# Altium schematic sheet 3-PWR_BAK_BATT.SCHDOC
size A4
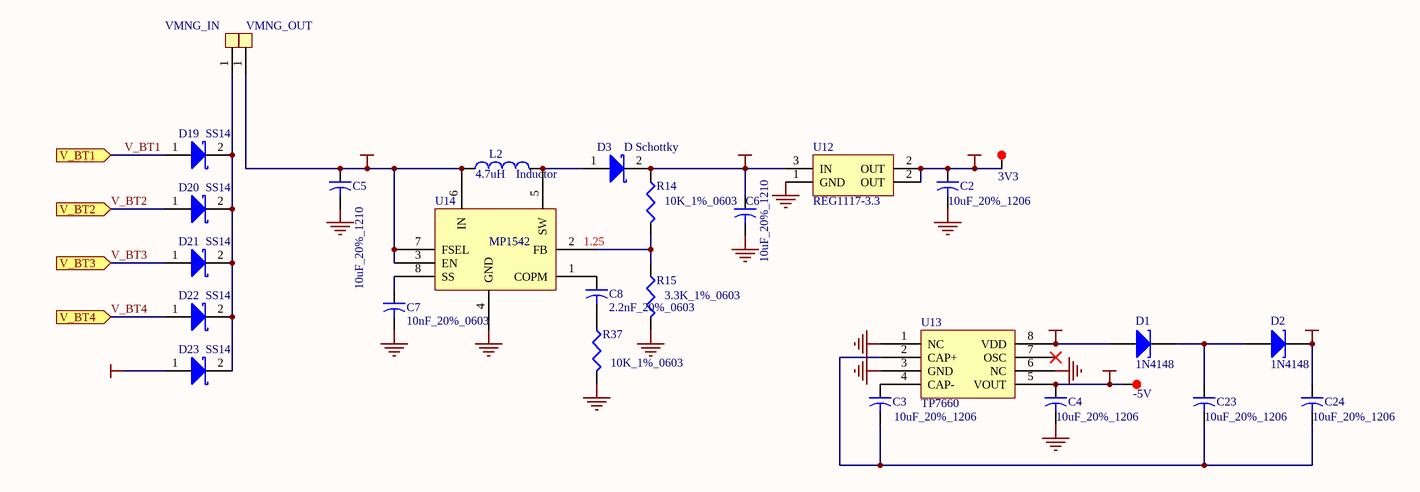
[diagram p0: 3-PWR_BAK_BATT.SCHDOC]

## Parts
3V3  TP  [TP_1MM]  (value not drawn)
-5V  TP  [TP_1MM]  (value not drawn)
C2  10uF_20%_1206  [CC3216-1206]
C3  10uF_20%_1206  [CC3216-1206]
C4  10uF_20%_1206  [CC3216-1206]
C5  10uF_20%_1210  [CC3225-1210]
C6  10uF_20%_1210  [CC3225-1210]
C7  10nF_20%_0603  [C1608-0603]
C8  2.2nF_20%_0603  [C1608-0603]
C23  10uF_20%_1206  [CC3216-1206]
C24  10uF_20%_1206  [CC3216-1206]
D1  1N4148  [LED0805]
D2  1N4148  [LED0805]
D3  D Schottky  [DO-214AB_SS14]
D19  SS14  [DO-214AB_SS14]
D20  SS14  [DO-214AB_SS14]
D21  SS14  [DO-214AB_SS14]
D22  SS14  [DO-214AB_SS14]
D23  SS14  [DO-214AB_SS14]
L2  Inductor  value 4.7uH  [L6x6x3_3A]
R14  10K_1%_0603  [C1608-0603]
R15  3.3K_1%_0603  [C1608-0603]
R37  10K_1%_0603  [C1608-0603]
U12  REG1117-3.3  [SOT223]
U13  TP7660  [SO-8]
U14  MP1542  [MSOP8]
VMNG_IN  ND  [END_3_6]  (value not drawn)
VMNG_OUT  ND  [END_3_6]  (value not drawn)

## Ports
V_BT1 (in), V_BT2 (in), V_BT3 (in), V_BT4 (in)

## Nets
GND: C2.2 C4.2 C5.2 C6.2 C7.2 R15.2 R37.2 U12.1(GND) U13.1(NC) U13.3(GND) U13.6(NC) U14.4(GND)
VCC_3V3: 3V3.1(TP) C2.1 U12.2(OUT)
VCC_5V: C6.1 D1.1(A) D3.2(K) R14.1 U12.3(IN) U13.8(VDD)
VCC_9V: C24.1 D2.2(K)
VCC_-5V: -5V.1(TP) C4.1 U13.5(VOUT)
VCC_CHARGE: D23.1(A)
VCC_MNG: C5.1 L2.1 U14.3(EN) U14.6(IN) U14.7(FSEL) VMNG_OUT.1(SW)
V_BT1: D19.1(A) ; port V_BT1
V_BT2: D20.1(A) ; port V_BT2
V_BT3: D21.1(A) ; port V_BT3
V_BT4: D22.1(A) ; port V_BT4
NetC3_1: C3.1 U13.4(CAP-)
NetC3_2: C3.2 C23.2 C24.2 U13.2(CAP+)
NetC7_1: C7.1 U14.8(SS)
NetC8_1: C8.1 U14.1(COPM)
NetC8_2: C8.2 R37.1
NetC23_1: C23.1 D1.2(K) D2.1(A)
NetD3_1: D3.1(A) L2.2 U14.5(SW)
NetD19_2: D19.2(K) D20.2(K) D21.2(K) D22.2(K) D23.2(K) VMNG_IN.1(SW)
NetR14_2: R14.2 R15.1 U14.2(FB)

Not connected (* = marked no-connect by the designer): U13 7(OSC)*

## Notes on the sheet
- 1.25

## Library data of the parts
3V3 -5V = TP_1mm
C2-C4 C23 C24 = Cap2: Capacitor; Value: 10uF; Published: 23-Sep-2002; Publisher: Altium Limited
C5-C8 = Cap2: Capacitor; Value: 0.1uF 20% 0603; Published: 23-Sep-2002; Publisher: Altium Limited
D1 D2 = D Tunnel1: Tunnel Diode - RLC Model; Published: 8-Jun-2000; LatestRevisionDate: 17-Jul-2002; LatestRevisionNote: Re-released for DXP Platform.; Publisher: Altium Limited
D3 D19-D23 = D Schottky: Schottky Diode; Code - JEDEC: DO-214-AA; Published: 8-Jun-2000; Revision: July-2002: Re-released for DXP Platform.; Publisher: Altium Limited
R14 R15 R37 = Res3: Resistor; Value: 1K%5 0603; Published: 8-Jun-2000; Revision: July-2002: Re-released for DXP Platform.; Publisher: Altium Limited
U12 = REG1117-5: Positive Regulator; Package Information: Latest Revision: revC; Published: 8-Jun-2000; Revision: 17-Jul-2002: Re-released for DXP Platform.; Datasheet: Latest Revision: Sep-1997; Package Reference: ZZ311; Publisher: Altium Limited
L2 = Inductor: Published: 8-Jun-2000; Revision: July-2002: Re-released for DXP Platform.; Publisher: Altium Limited